# EAGLE design input (EAGLE 9.4.2)
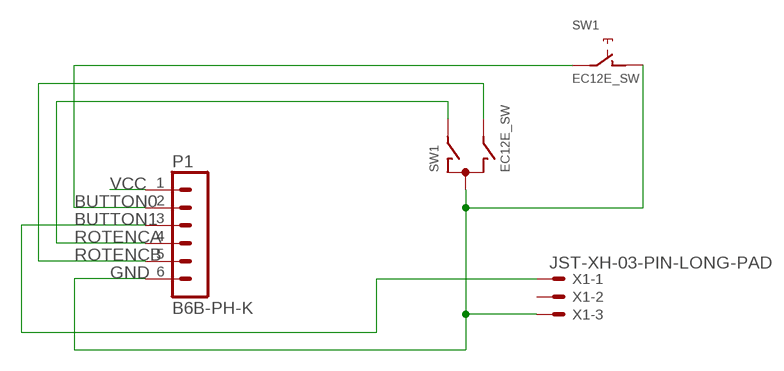
[diagram p0: schematic, sheet 1]

## Parts
P1  B6B-PH-K  [B6B-PH-K]
SW1  EC12E_SW  [ALPS_EC12E_SW]
X1  JST-XH-03-PIN-LONG-PAD  [JST-XH-03-PACKAGE-LONG-PAD]

## Nets
BUTTON0: P1.2 SW1.E
BUTTON1: P1.3 X1.1
GND: P1.6 SW1.C SW1.D X1.3
ROTENCA: P1.4 SW1.A
ROTENCB: P1.5 SW1.B
VCC: P1.1
Unconnected: SW1.GND1(G) SW1.GND2(G) X1.2

## Library data of the parts
P1 = con-jst-ph:B6B-PH-K: HEADER
SW1 = switch-alps:EC12E_SW: ALPS rotary Encoder EC12E series with switch; MPN: EC12E2424407; OC_FARNELL: 1520813; OC_NEWARK: 74M1068
X1 = Rembrandt Electronics - JST XH Connectors v1-0:JST-XH-03-PIN: JST XH Connector 2 Pin Wire to board connector. Pitch: 2,54 mm, (0.100") Number of pins: 3 Created by Rembrandt Electronics www.rembrandtelectronics.com

## Board
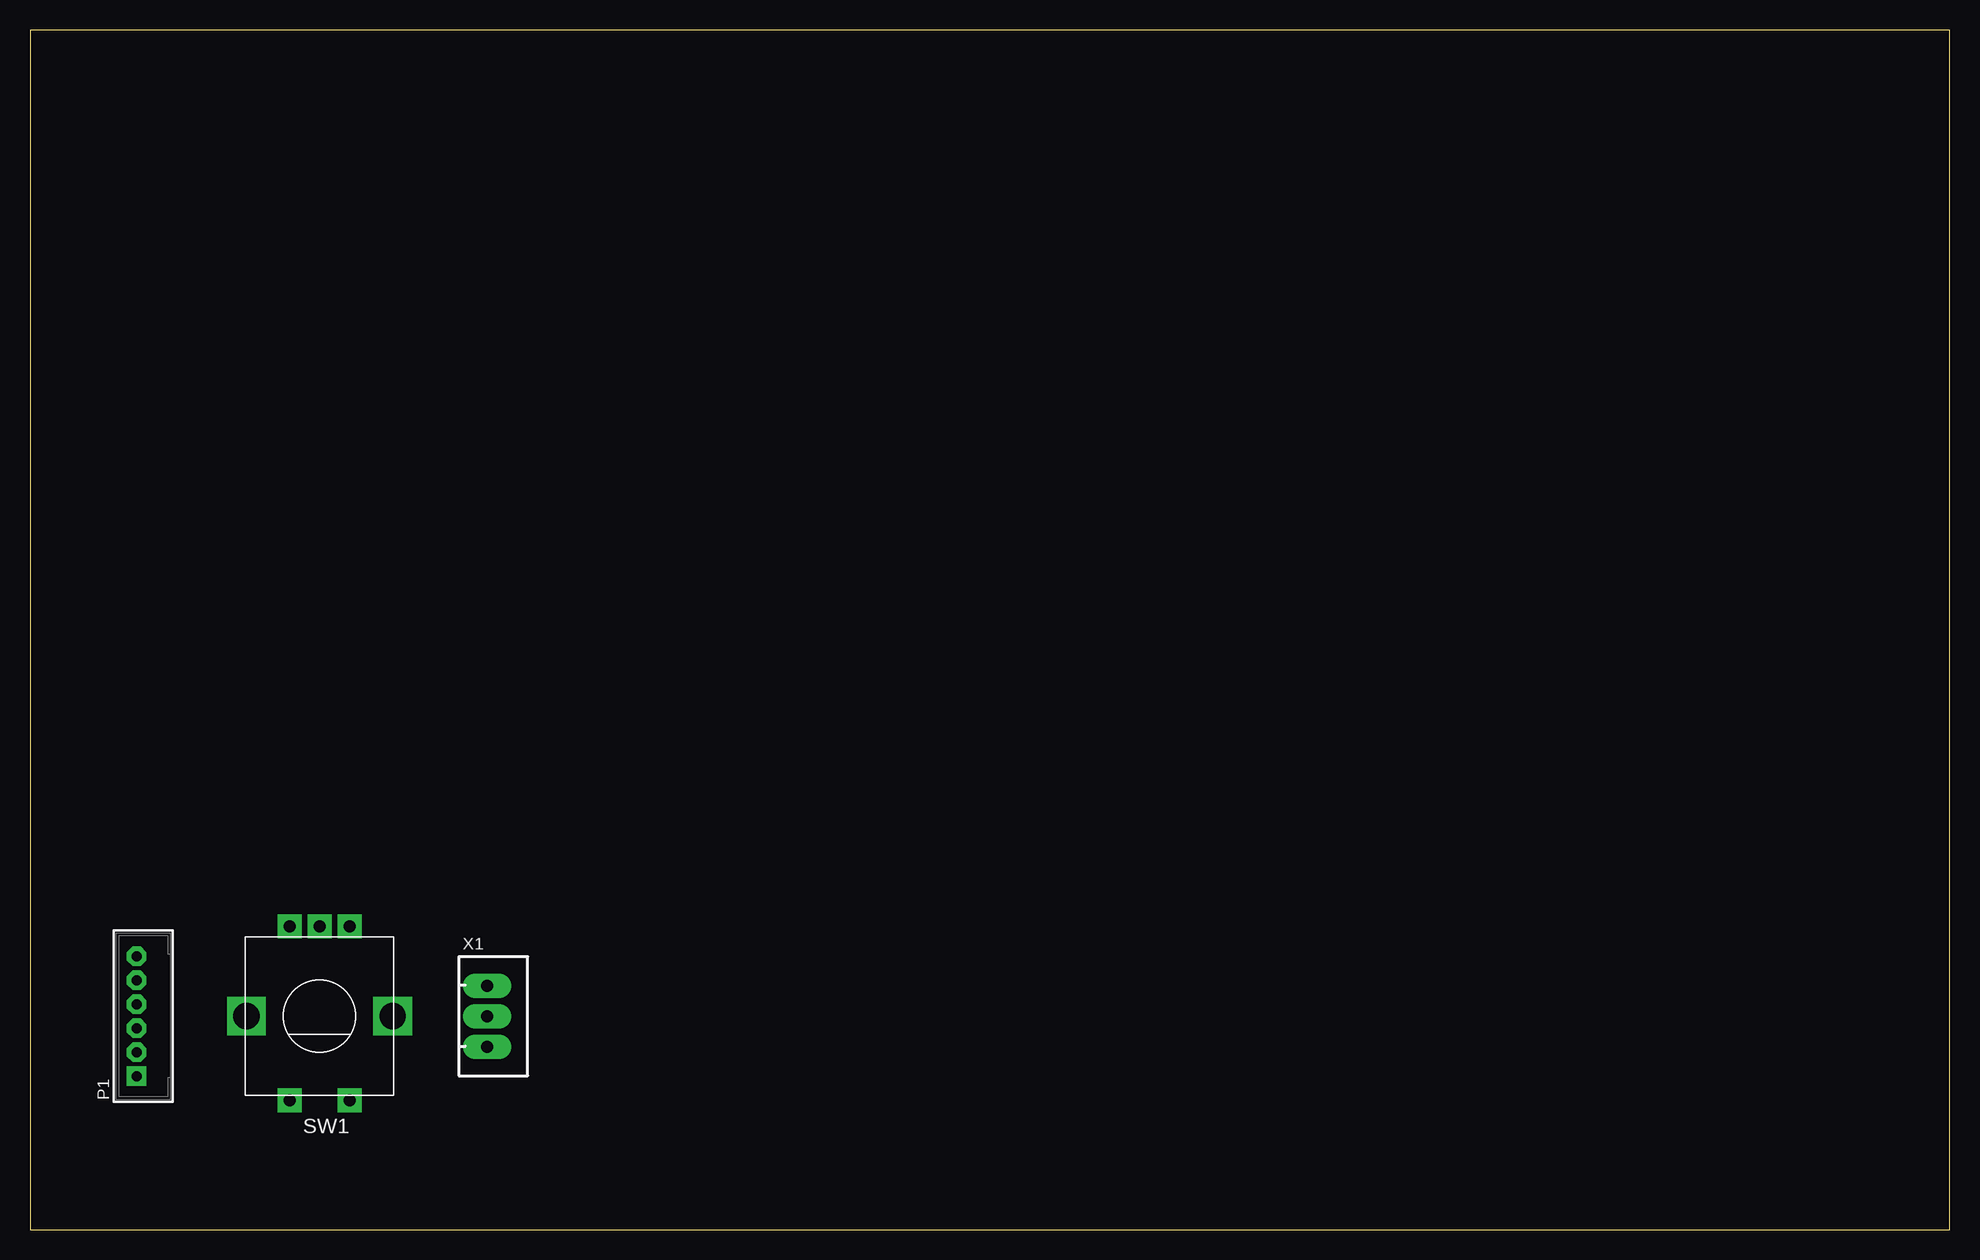
[diagram p1: board, top side]
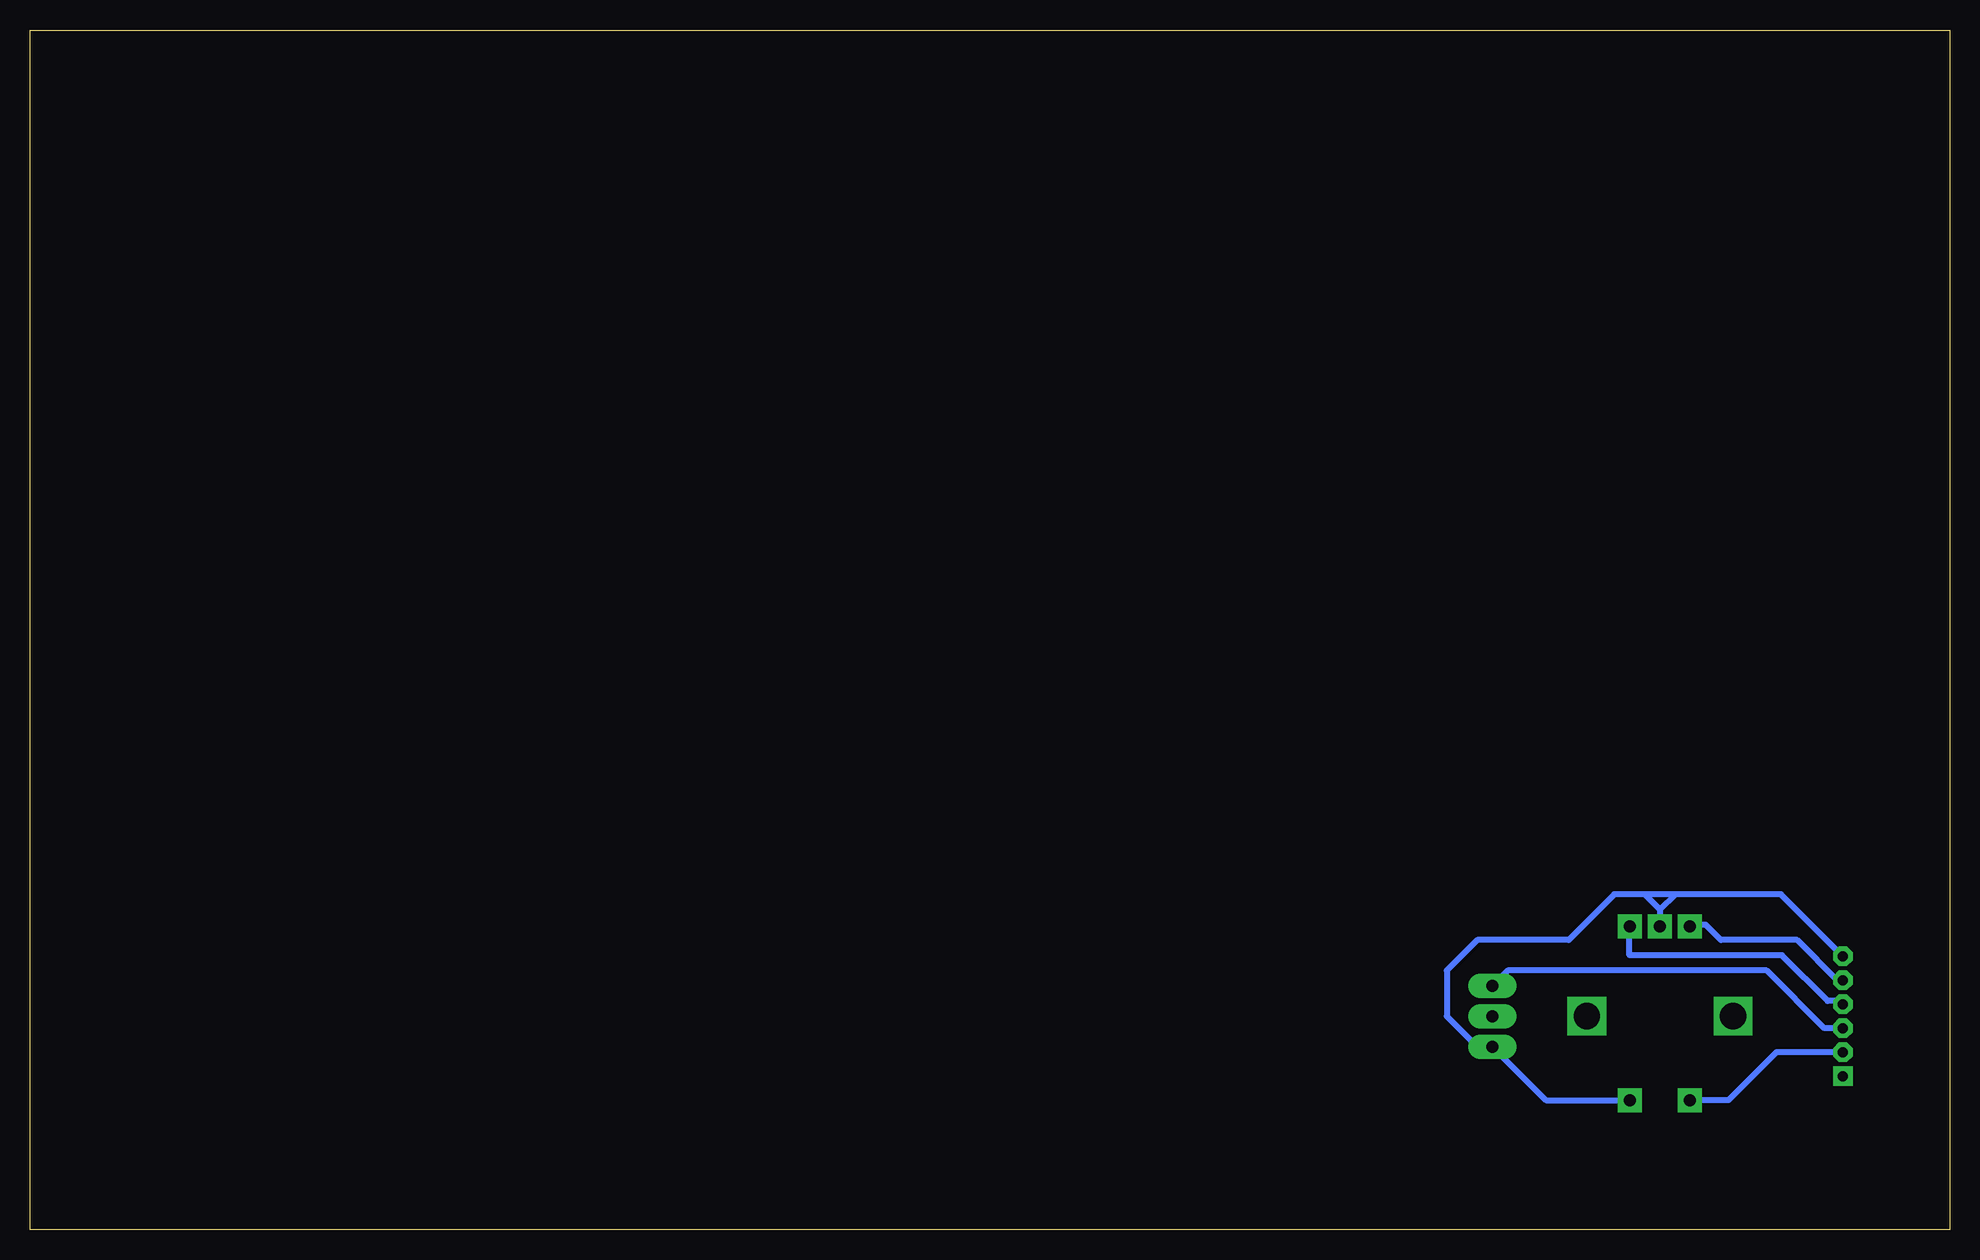
[diagram p2: board, bottom side, seen from below]

Size 160 x 100 mm. Coordinates in mm from the lower left corner, seen from the top.
Outline: 0,0 160,0 160,100 0,100 0,0
Copper layers (1*16): Top 0.035mm / dielectric 1.5mm / Bottom 0.035mm
Design rules "default *": minimum track width 6mil, minimum drill 0.65mm, track to track 6mil, track to pad 6mil, pad to pad 6mil, via to via 6mil, smd to smd 6mil, copper to edge 40mil, drill to drill 6mil, minimum pad ring 10mil, minimum via ring 8mil, stop-mask expansion 4mil, vias tented up to drill 0mil, thermal gap 10mil

### Footprints (pad centres in the part's own frame; a part is rotated, then mirrored left to right if it is on the bottom)
B6B-PH-K = drill 0.813 square: 1 -5,0 | drill 0.813 octagon: 2 -3,0; 3 -1,0; 4 1,0; 5 3,0; 6 5,0
ALPS_EC12E_SW = drill 1 square: A -2.5,-7.5; B 2.5,-7.5; C 0,-7.5; D -2.5,7; E 2.5,7 | drill 2.2 square: GND1 -6.1,0; GND2 6.1,0
JST-XH-03-PACKAGE-LONG-PAD = drill 1.016 long: 1 -2.54,0; 2 0,0; 3 2.54,0

### Placement (x,y rotation side)
P1  8.89,17.78 90 top
SW1  24.13,17.78 180 top
X1  38.1,17.78 270 top

### Tracks (layer width: path | path; a pad name or v marks a point on that pad's centre or on a via)
BUTTON0
  Bottom 0.5: P1.2 14.43,14.78 18.43,10.78 SW1.E
BUTTON1
  Bottom 0.5: P1.3 10.43,16.78 15.24,21.59 36.83,21.59 X1.1
GND
  Bottom 0.5: 24.13,26.67 25.4,27.94 | 25.4,27.94 27.94,27.94 31.75,24.13 39.37,24.13 41.91,21.59 41.91,17.78 39.37,15.24 X1.3 33.64,10.78 SW1.D | P1.6 14.05,27.94 22.86,27.94 | 22.86,27.94 24.13,26.67 | 24.13,26.67 SW1.C | 22.86,27.94 25.4,27.94
ROTENCA
  Bottom 0.5: P1.4 9.16,19.05 10.16,19.05 13.97,22.86 26.67,22.86 26.67,25.24 SW1.A
ROTENCB
  Bottom 0.5: P1.5 9.35,20.78 12.7,24.13 19.05,24.13 20.32,25.4 21.51,25.4 SW1.B